# Altium schematic sheet LPCB221 - LIMIT SWITCHES.SchDoc
size A3; Address1: Factory 10; Address2: 9-13 Dingley Avenue, Dandeong, VICTORIA 3175, AUSTRALIA; DocumentNumber: 4; Revision: 1; SheetNumber: 4; SheetTotal: 6; Lockie__PCB_SUB_ASSEMBLY: Limit Switches; Lockie__PCB_ASSEMBLY: Node Base; Lockie__LDL: LPCB221; Lockie__PCB_DESCRIPTION: Gimbal Node
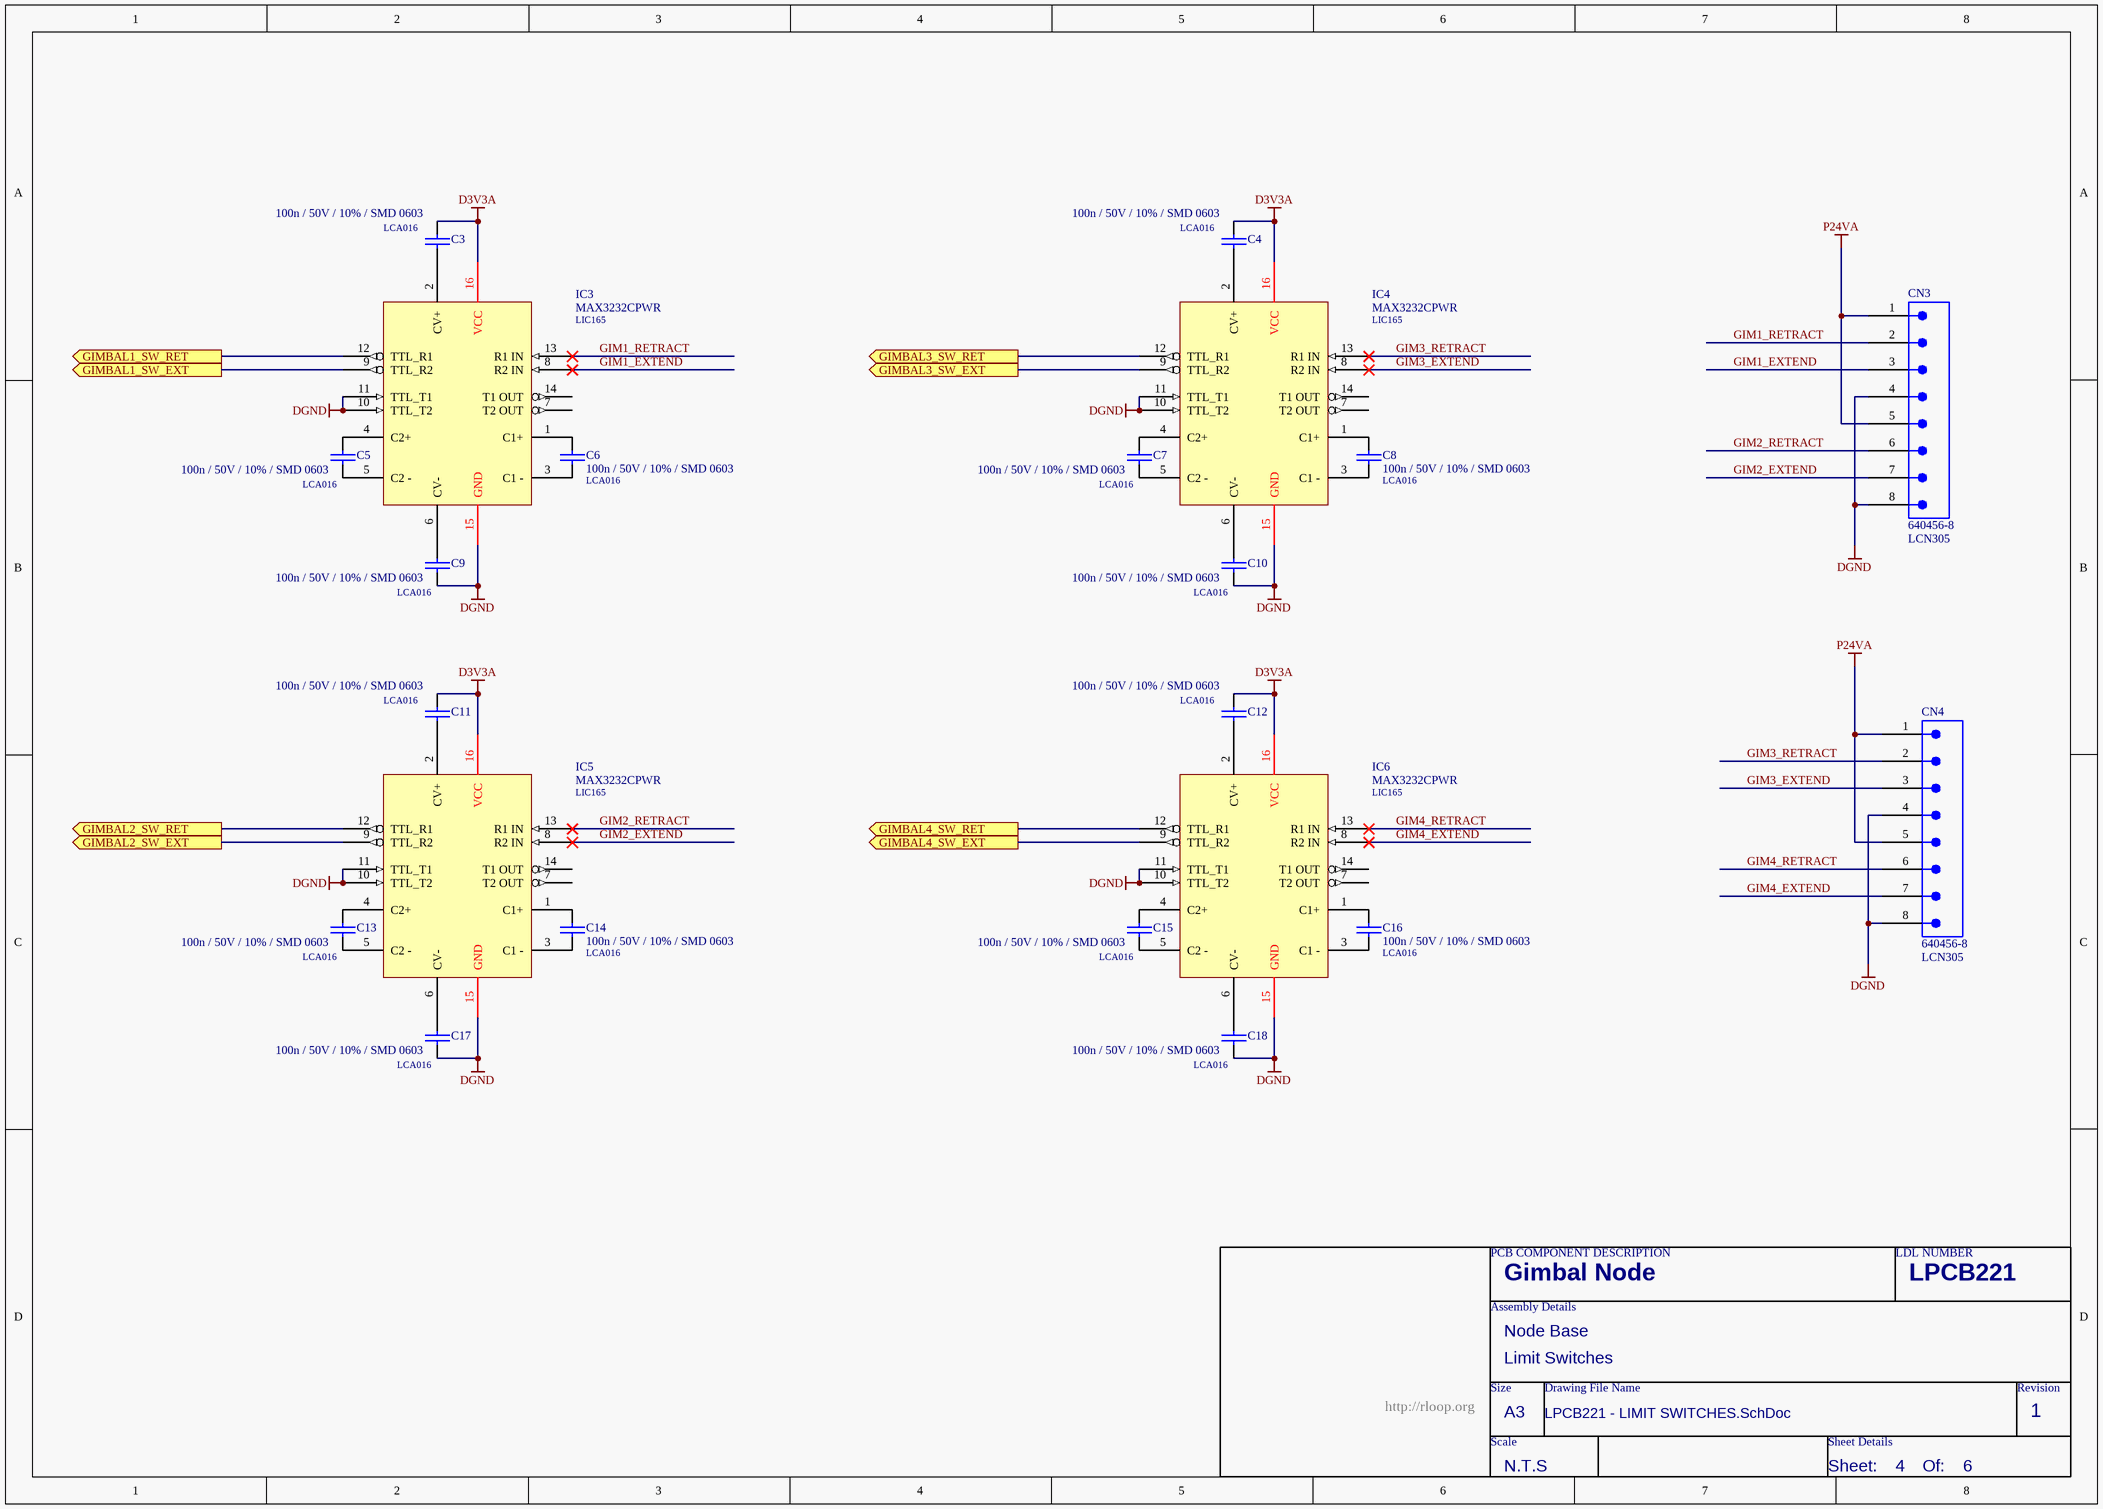
[diagram p0: LPCB221 - LIMIT SWITCHES.SchDoc]

## Parts
C3  100n / 50V / 10% / SMD 0603  LDL_NUMBER: LCA016  [LFP011__CC1608-0603-IPC7351_B]
C4  100n / 50V / 10% / SMD 0603  LDL_NUMBER: LCA016  [LFP011__CC1608-0603-IPC7351_B]
C5  100n / 50V / 10% / SMD 0603  LDL_NUMBER: LCA016  [LFP011__CC1608-0603-IPC7351_B]
C6  100n / 50V / 10% / SMD 0603  LDL_NUMBER: LCA016  [LFP011__CC1608-0603-IPC7351_B]
C7  100n / 50V / 10% / SMD 0603  LDL_NUMBER: LCA016  [LFP011__CC1608-0603-IPC7351_B]
C8  100n / 50V / 10% / SMD 0603  LDL_NUMBER: LCA016  [LFP011__CC1608-0603-IPC7351_B]
C9  100n / 50V / 10% / SMD 0603  LDL_NUMBER: LCA016  [LFP011__CC1608-0603-IPC7351_B]
C10  100n / 50V / 10% / SMD 0603  LDL_NUMBER: LCA016  [LFP011__CC1608-0603-IPC7351_B]
C11  100n / 50V / 10% / SMD 0603  LDL_NUMBER: LCA016  [LFP011__CC1608-0603-IPC7351_B]
C12  100n / 50V / 10% / SMD 0603  LDL_NUMBER: LCA016  [LFP011__CC1608-0603-IPC7351_B]
C13  100n / 50V / 10% / SMD 0603  LDL_NUMBER: LCA016  [LFP011__CC1608-0603-IPC7351_B]
C14  100n / 50V / 10% / SMD 0603  LDL_NUMBER: LCA016  [LFP011__CC1608-0603-IPC7351_B]
C15  100n / 50V / 10% / SMD 0603  LDL_NUMBER: LCA016  [LFP011__CC1608-0603-IPC7351_B]
C16  100n / 50V / 10% / SMD 0603  LDL_NUMBER: LCA016  [LFP011__CC1608-0603-IPC7351_B]
C17  100n / 50V / 10% / SMD 0603  LDL_NUMBER: LCA016  [LFP011__CC1608-0603-IPC7351_B]
C18  100n / 50V / 10% / SMD 0603  LDL_NUMBER: LCA016  [LFP011__CC1608-0603-IPC7351_B]
CN3  640456-8  LDL_NUMBER: LCN305  [640456-8]
CN4  640456-8  LDL_NUMBER: LCN305  [640456-8]
IC3  MAX3232CPWR  LDL_NUMBER: LIC165  [LFP049__TSSOP-16]
IC4  MAX3232CPWR  LDL_NUMBER: LIC165  [LFP049__TSSOP-16]
IC5  MAX3232CPWR  LDL_NUMBER: LIC165  [LFP049__TSSOP-16]
IC6  MAX3232CPWR  LDL_NUMBER: LIC165  [LFP049__TSSOP-16]

## Ports
GIMBAL1_SW_EXT (out), GIMBAL1_SW_RET (out), GIMBAL2_SW_EXT (out), GIMBAL2_SW_RET (out), GIMBAL3_SW_EXT (out), GIMBAL3_SW_RET (out), GIMBAL4_SW_EXT (out), GIMBAL4_SW_RET (out)

## Nets
D3V3A: C3.1 C4.1 C11.1 C12.1 IC3.16(VCC) IC4.16(VCC) IC5.16(VCC) IC6.16(VCC)
DGND: C9.2 C10.2 C17.2 C18.2 CN3.4 CN3.8 CN4.4 CN4.8 IC3.10(TTL_T2) IC3.11(TTL_T1) IC3.15(GND) IC4.10(TTL_T2) IC4.11(TTL_T1) IC4.15(GND) IC5.10(TTL_T2) IC5.11(TTL_T1) IC5.15(GND) IC6.10(TTL_T2) IC6.11(TTL_T1) IC6.15(GND)
P24VA: CN3.1 CN3.5 CN4.1 CN4.5
GIM1_EXTEND: CN3.3 IC3.8(R2_IN)
GIM1_RETRACT: CN3.2 IC3.13(R1_IN)
GIM2_EXTEND: CN3.7 IC5.8(R2_IN)
GIM2_RETRACT: CN3.6 IC5.13(R1_IN)
GIM3_EXTEND: CN4.3 IC4.8(R2_IN)
GIM3_RETRACT: CN4.2 IC4.13(R1_IN)
GIM4_EXTEND: CN4.7 IC6.8(R2_IN)
GIM4_RETRACT: CN4.6 IC6.13(R1_IN)
GIMBAL1_SW_EXT: IC3.9(TTL_R2) ; port GIMBAL1_SW_EXT
GIMBAL1_SW_RET: IC3.12(TTL_R1) ; port GIMBAL1_SW_RET
GIMBAL2_SW_EXT: IC5.9(TTL_R2) ; port GIMBAL2_SW_EXT
GIMBAL2_SW_RET: IC5.12(TTL_R1) ; port GIMBAL2_SW_RET
GIMBAL3_SW_EXT: IC4.9(TTL_R2) ; port GIMBAL3_SW_EXT
GIMBAL3_SW_RET: IC4.12(TTL_R1) ; port GIMBAL3_SW_RET
GIMBAL4_SW_EXT: IC6.9(TTL_R2) ; port GIMBAL4_SW_EXT
GIMBAL4_SW_RET: IC6.12(TTL_R1) ; port GIMBAL4_SW_RET
NetC3_2: C3.2 IC3.2(CV+)
NetC4_2: C4.2 IC4.2(CV+)
NetC5_1: C5.1 IC3.4(C2+)
NetC5_2: C5.2 IC3.5(C2_-)
NetC6_1: C6.1 IC3.1(C1+)
NetC6_2: C6.2 IC3.3(C1_-)
NetC7_1: C7.1 IC4.4(C2+)
NetC7_2: C7.2 IC4.5(C2_-)
NetC8_1: C8.1 IC4.1(C1+)
NetC8_2: C8.2 IC4.3(C1_-)
NetC9_1: C9.1 IC3.6(CV-)
NetC10_1: C10.1 IC4.6(CV-)
NetC11_2: C11.2 IC5.2(CV+)
NetC12_2: C12.2 IC6.2(CV+)
NetC13_1: C13.1 IC5.4(C2+)
NetC13_2: C13.2 IC5.5(C2_-)
NetC14_1: C14.1 IC5.1(C1+)
NetC14_2: C14.2 IC5.3(C1_-)
NetC15_1: C15.1 IC6.4(C2+)
NetC15_2: C15.2 IC6.5(C2_-)
NetC16_1: C16.1 IC6.1(C1+)
NetC16_2: C16.2 IC6.3(C1_-)
NetC17_1: C17.1 IC5.6(CV-)
NetC18_1: C18.1 IC6.6(CV-)

Not connected (* = marked no-connect by the designer): IC3 7(T2_OUT) 14(T1_OUT); IC4 7(T2_OUT) 14(T1_OUT); IC5 7(T2_OUT) 14(T1_OUT); IC6 7(T2_OUT) 14(T1_OUT)

## Notes on the sheet
- PCB COMPONENT DESCRIPTION
- LDL NUMBER
- Assembly Details
- Size
- Drawing File Name
- Revision
- http://rloop.org
- Scale
- A3
- Sheet Details
- N.T.S
- Sheet:
- Of:

## Library data of the parts
C3-C18 = 100n / 50V / 10% / SMD 0603: Capacitor, Ceramic Chip, 100nF (0.1uF), 50V, 5%, SMD 0603 [LCA016]; FMEDA__OPERATING__VOLTAGE_MIN: 0; FMEDA__OPERATING__VOLTAGE_MAX: 3.3; FMEDA__OPERATING__TEMP_MIN: -20; FMEDA__OPERATING__TEMP_TYP: 27; FMEDA__OPERATING__TEMP_MAX: 50; FMEDA__CHANNEL: COM; Value: 100n; FMEDA__FUNCTION_IN_SYSTEM: *; FMEDA__OPERATING__VOLTAGE_TYP: 3.3
CN3 CN4 = 640456-8: Connector, Male Header, 8 Way; FMEDA__CHANNEL: COM; FMEDA__OPERATING__CURRENT_MAX: 0; FMEDA__OPERATING__TEMP_MAX: 50; FMEDA__OPERATING__TEMP_MIN: -20; FMEDA__OPERATING__TEMP_TYP: 27; FMEDA__OPERATING__VOLTAGE_MAX: 16; FMEDA__OPERATING__VOLTAGE_TYP: 12; FMEDA__FUNCTION_IN_SYSTEM: *; FMEDA__OPERATING__CURRENT_MIN: 0; FMEDA__OPERATING__CURRENT_TYP: 0; FMEDA__OPERATING__VOLTAGE_MIN: 0
IC3-IC6 = MAX3232CPWR: IC, RS232 Line Driver, 3.3V, SMD TSSOP16 [LIC165]; FMEDA__OPERATING__TEMP_MAX: 50; FMEDA__OPERATING__TEMP_MIN: -20; FMEDA__OPERATING__TEMP_TYP: 27; FMEDA__CHANNEL: COM; FMEDA__OPERATING__VOLTAGE_MAX: 3.3; FMEDA__OPERATING__VOLTAGE_MIN: 0; FMEDA__FUNCTION_IN_SYSTEM: *; FMEDA__OPERATING__VOLTAGE_TYP: 3.3